# EAGLE schematic 4BitCounter (EAGLE 7.6.0)
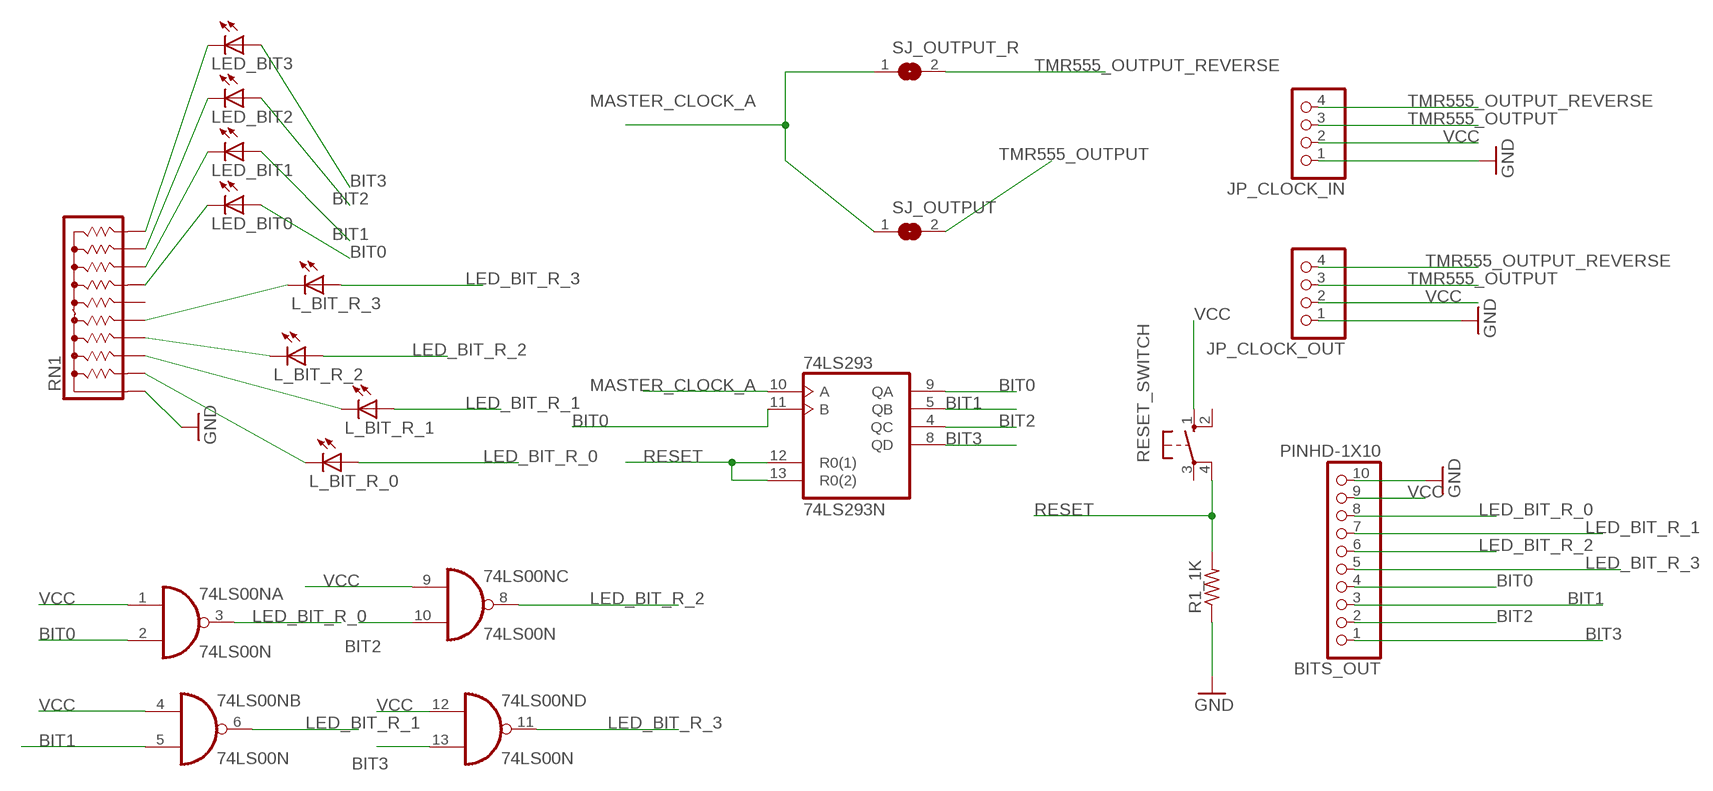
[diagram p0: schematic, sheet 1]

## Parts
74LS00N  74LS00N  [DIL14]
74LS293  74LS293N  [DIL14]
BITS_OUT  PINHD-1X10  [1X10-BIG]
JP_CLOCK_IN  PINHD-1X4  [1X04]
JP_CLOCK_OUT  PINHD-1X4  [1X04]
L_BIT_R_0  LEDSMT1206  [1206]
L_BIT_R_1  LEDSMT1206  [1206]
L_BIT_R_2  LEDSMT1206  [1206]
L_BIT_R_3  LEDSMT1206  [1206]
LED_BIT0  LEDSMT1206  [1206]
LED_BIT1  LEDSMT1206  [1206]
LED_BIT2  LEDSMT1206  [1206]
LED_BIT3  LEDSMT1206  [1206]
R1_1K  R-US_R1206  [R1206]
RESET_SWITCH  10-XX  [B3F-10XX]
RN1  4610X  [SIP10]
SJ_OUTPUT  SOLDERJUMPERREFLOW  [SOLDERJUMPER_REFLOW]
SJ_OUTPUT_R  SOLDERJUMPERREFLOW  [SOLDERJUMPER_REFLOW]

## Nets
BIT0: 74LS00N.2(A:I1) 74LS293.9(QA) 74LS293.11(B) BITS_OUT.4 LED_BIT0.A
BIT1: 74LS00N.5(B:I1) 74LS293.5(QB) BITS_OUT.3 LED_BIT1.A
BIT2: 74LS00N.10(C:I1) 74LS293.4(QC) BITS_OUT.2 LED_BIT2.A
BIT3: 74LS00N.13(D:I1) 74LS293.8(QD) BITS_OUT.1 LED_BIT3.A
GND: BITS_OUT.10 JP_CLOCK_IN.1 JP_CLOCK_OUT.1 R1_1K.1 RN1.1
LED_BIT_R_0: 74LS00N.3(A:O) BITS_OUT.8 L_BIT_R_0.A
LED_BIT_R_1: 74LS00N.6(B:O) BITS_OUT.7 L_BIT_R_1.A
LED_BIT_R_2: 74LS00N.8(C:O) BITS_OUT.6 L_BIT_R_2.A
LED_BIT_R_3: 74LS00N.11(D:O) BITS_OUT.5 L_BIT_R_3.A
MASTER_CLOCK_A: 74LS293.10(A) SJ_OUTPUT.1 SJ_OUTPUT_R.1
N$1: LED_BIT1.C RN1.8
N$2: LED_BIT0.C RN1.7
N$3: LED_BIT2.C RN1.9
N$4: LED_BIT3.C RN1.10
N$5: L_BIT_R_0.C RN1.2
N$6: L_BIT_R_1.C RN1.3
N$7: L_BIT_R_2.C RN1.4
N$8: L_BIT_R_3.C RN1.5
RESET: 74LS293.12(R0(1)) 74LS293.13(R0(2)) R1_1K.2 RESET_SWITCH.4(P1)
TMR555_OUTPUT: JP_CLOCK_IN.3 JP_CLOCK_OUT.3 SJ_OUTPUT.2
TMR555_OUTPUT_REVERSE: JP_CLOCK_IN.4 JP_CLOCK_OUT.4 SJ_OUTPUT_R.2
VCC: 74LS00N.1(A:I0) 74LS00N.4(B:I0) 74LS00N.9(C:I0) 74LS00N.12(D:I0) BITS_OUT.9 JP_CLOCK_IN.2 JP_CLOCK_OUT.2 RESET_SWITCH.1(S)
Unconnected: RESET_SWITCH.2(S1) RESET_SWITCH.3(P) RN1.6

## Power pins joined to a net without a drawn wire
GND: 74LS00N.7(P:GND) 74LS293.7(GND)
VCC: 74LS00N.14(P:VCC) 74LS293.14(VCC)

## Library data of the parts
74LS00N = 74xx-eu:74*00: Quad 2-input NAND gate
74LS293 = 74xx-eu:74*293: Decade and 4-bit BINARY COUNTER
BITS_OUT = adafruit:PINHD-1X10: Pin header 1x10 0.1" spacing With round pins
JP_CLOCK_IN JP_CLOCK_OUT = pinhead:PINHD-1X4: PIN HEADER
L_BIT_R_0 L_BIT_R_1-L_BIT_R_3 LED_BIT0 LED_BIT1-LED_BIT3 = adafruit:LED: LED OSRAM: - CHIPLED LG R971, LG N971, LY N971, LG Q971, LY Q971, LO R971, LY R971 LH N974, LH R974 LS Q976, LO Q976, LY Q976 LO Q996 - Hyper CHIPLED LW Q18S LB Q993, LB Q99A, LB R99A - SideLED LS A670, LO A670, LY A670, LG A670, LP A670 LB A673, LV A673, LT A673, LW A673 LH A674 LY A675 LS A676, LA A676, LO A676, LY A676, LW A676 LS A679, LY A679, LG A679 - Hyper Micro SIDELED® LS Y876, LA Y876, LO Y876, LY Y876 LT Y87S - SmartLED LW L88C, LW L88S LB L89C, LB L89S, LG L890 LS L89K, LO L89K, LY L89K LS L896, LA L896, LO L896, LY L896 - TOPLED LS T670, LO T670, LY T670, LG T670, LP T670 LSG T670, LSP T670, LSY T670, LOP T670, LYG T670 LG T671, LOG T671, LSG T671 LB T673, LV T673, LT T673, LW T673 LH T674 LS T676, LA T676, LO T676, LY T676, LB T676, LH T676, LSB T676, LW T676 LB T67C, LV T67C, LT T67C, LS T67K, LO T67K, LY T67K, LW E67C LS E67B, LA E67B, LO E67B, LY E67B, LB E67C, LV E67C, LT E67C LW T67C LS T679, LY T679, LG T679 LS T770, LO T770, LY T770, LG T770, LP T770 LB T773, LV T773, LT T773, LW T773 LH T774 LS E675, LA E675, LY E675, LS T675 LS T776, LA T776, LO T776, LY T776, LB T776 LHGB T686 LT T68C, LB T68C - Hyper Mini TOPLED® LB M676 - Mini TOPLED Santana® LG M470 LS M47K, LO M47K, LY M47K Source: http://www.osram.convergy.de/
R1_1K = adafruit:R-US_: RESISTOR, American symbol
RESET_SWITCH = switch-omron:10-XX: OMRON SWITCH; MPN: B3F-1000; OC_FARNELL: 176432; OC_NEWARK: 36M3542
RN1 = resistor-sip:4610X: Bourns 4600X Series - Thick Film Conformal SIPs 4610X-101 Resistor Network Configuration: 101 (Bussed Resistors) Resistance range: 10 ohms to 10 Megaohms Maximum Operating Voltage: 100V Source: http://www.bourns.com/ProductLine.aspx?name=standard_thick_film_networks PDF: http://www.bourns.com/data/global/pdfs/4600X.pdf
SJ_OUTPUT SJ_OUTPUT_R = microbuilder:SOLDERJUMPER: SMD Solder JUMPER Solder the two pads together to create a connection, or remove the solder to break it. REFLOW - Use this footprint for solder paste and reflow ovens. WAVE - Use this footprint for hand-soldering (larger pads). CLOSED - Has a trace between the two pads to ensure it is closed by default. The trace needs to be cut to disable the jumper, and can be closed again by creating a solder bridge between the two pads.